# Altium schematic sheet main.SchDoc
size A4; SheetNumber: 1; SheetTotal: 5
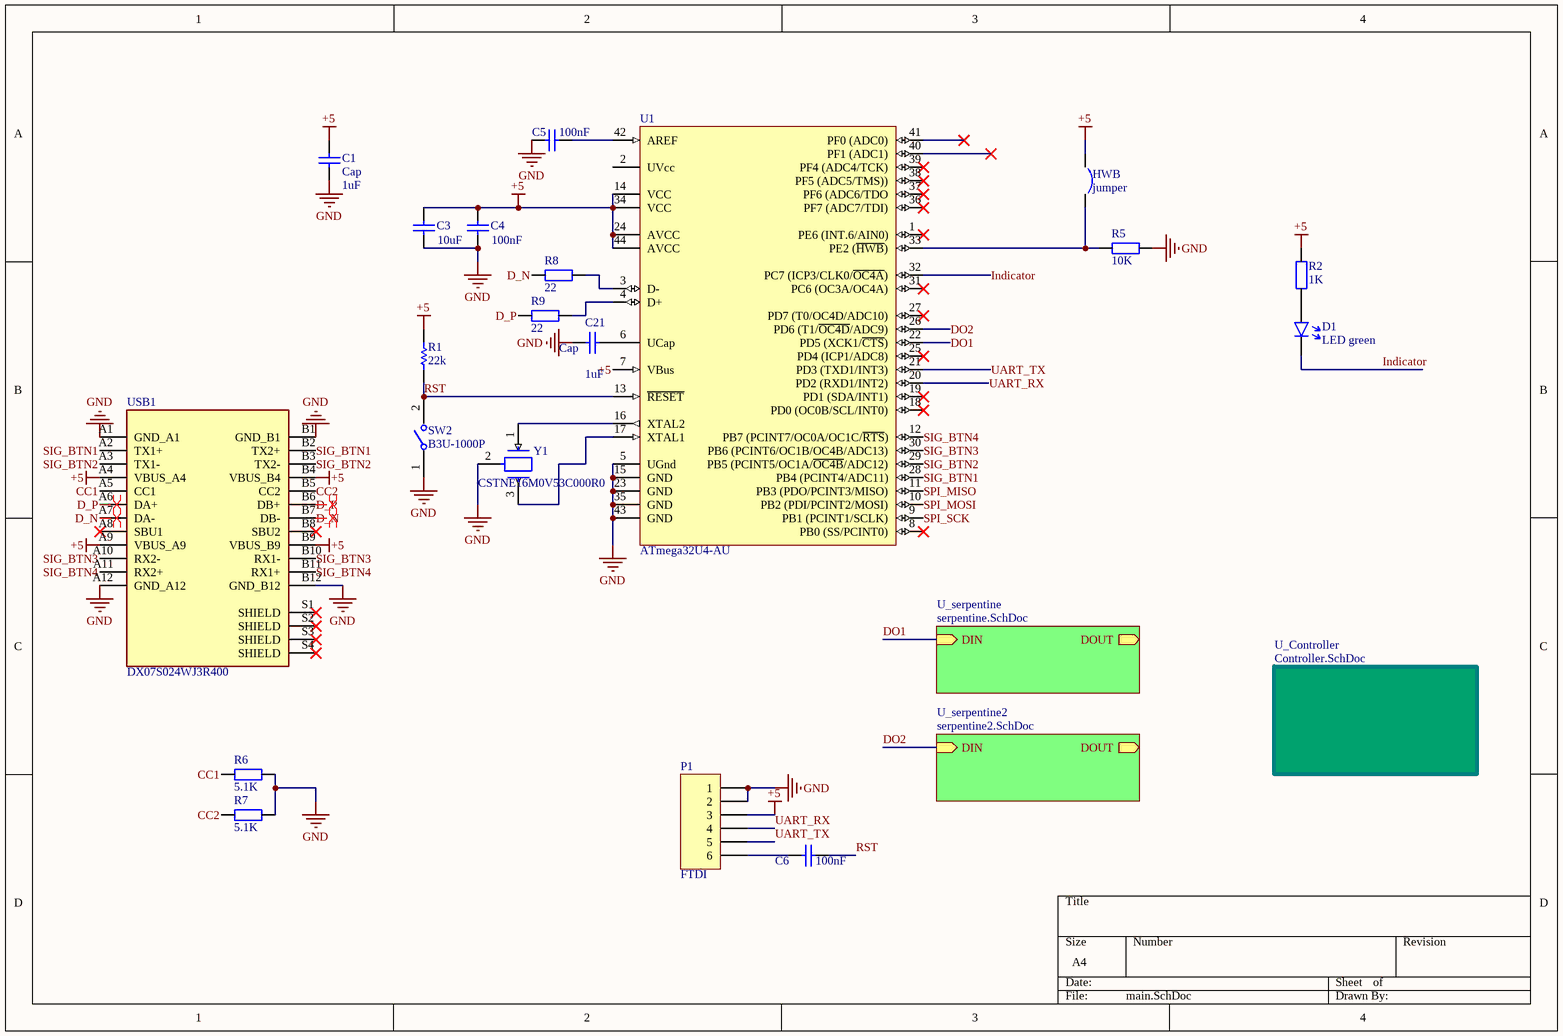
[diagram p0: main.SchDoc]

## Parts
C1  Cap  value 1uF  [6-0805_M]
C3  value 10uF  [6-0805_N]  (hidden comment: Cap)
C4  value 100nF  [6-0805_N]  (hidden comment: Cap)
C5  value 100nF  [6-0805_N]  (hidden comment: Cap)
C6  value 100nF  [6-0805_N]  (hidden comment: Cap)
C21  Cap  value 1uF  [6-0805_N]
D1  LED green  [LED0805]
HWB  jumper  [smd jumper]
P1  FTDI  [HDR1X6H]
R1  22k  [6-0805_N]
R2  1K  [RES0805]
R5  10K  [RES0805]
R6  5.1K  [RES0805]
R7  5.1K  [RES0805]
R8  22  [RES0805]
R9  22  [RES0805]
SW2  B3U-1000P  [FP-B3U-1000P-MFG]
U1  ATmega32U4-AU  [44ML_M]
USB1  DX07S024WJ3R400  [JAE_DX07S024WJ3R400]
Y1  CSTNE16M0V53C000R0  [FP-CSTNE16M0V53C000R0-MFG]

## Sub-sheets
U_Controller = Controller.SchDoc: no entries
U_serpentine = serpentine.SchDoc: DIN (in), DOUT (out)
U_serpentine2 = serpentine2.SchDoc: DIN (in), DOUT (out)

## Nets
+5: C1.1 C3.1 C4.1 HWB.1 P1.3 R1.2 R2.1 U1.7(VBus) U1.14(VCC) U1.24(AVCC) U1.34(VCC) U1.44(AVCC) USB1.A4(VBUS_A4) USB1.A9(VBUS_A9) USB1.B4(VBUS_B4) USB1.B9(VBUS_B9)
GND: C1.2 C3.2 C4.2 C5.2 C21.2 P1.1 P1.2 R5.2 R6.2 R7.2 SW2.1 U1.5(UGnd) U1.15(GND) U1.23(GND) U1.35(GND) U1.43(GND) USB1.A1(GND_A1) USB1.A12(GND_A12) USB1.B1(GND_B1) USB1.B12(GND_B12) Y1.2(GND)
CC1: R6.1 USB1.A5(CC1)
CC2: R7.1 USB1.B5(CC2)
D_N: R8.1 USB1.A7(DA-) USB1.B7(DB-)
D_P: R9.1 USB1.A6(DA+) USB1.B6(DB+)
DO1: U1.22(PD5_(XCK1/~{CTS})) ; sheet U_serpentine/DIN
DO2: U1.26(PD6_(T1/~{OC4D}/ADC9)) ; sheet U_serpentine2/DIN
Indicator: D1.2 U1.32(PC7_(ICP3/CLK0/~{OC4A}))
RST: C6.1 R1.1 SW2.2 U1.13(~{RESET})
SIG_BTN1: U1.28(PB4_(PCINT4/ADC11)) USB1.A2(TX1+) USB1.B2(TX2+)
SIG_BTN2: U1.29(PB5_(PCINT5/OC1A/~{OC4B}/ADC12)) USB1.A3(TX1-) USB1.B3(TX2-)
SIG_BTN3: U1.30(PB6_(PCINT6/OC1B/OC4B/ADC13)) USB1.A10(RX2-) USB1.B10(RX1-)
SIG_BTN4: U1.12(PB7_(PCINT7/OC0A/OC1C/~{RTS})) USB1.A11(RX2+) USB1.B11(RX1+)
SPI_MISO: U1.11(PB3_(PDO/PCINT3/MISO))
SPI_MOSI: U1.10(PB2_(PDI/PCINT2/MOSI))
SPI_SCK: U1.9(PB1_(PCINT1/SCLK))
UART_RX: P1.4 U1.20(PD2_(RXD1/INT2))
UART_TX: P1.5 U1.21(PD3_(TXD1/INT3))
NetC5_1: C5.1 U1.42(AREF)
NetC6_2: C6.2 P1.6
NetC21_1: C21.1 U1.6(UCap)
NetD1_1: D1.1(A) R2.2
NetHWB_2: HWB.2 R5.1 U1.33(PE2_(~{HWB}))
NetR8_2: R8.2 U1.3(D-)
NetR9_2: R9.2 U1.4(D+)
NetU1_16: U1.16(XTAL2) Y1.1(Input)
NetU1_17: U1.17(XTAL1) Y1.3(Output)

Not connected (* = marked no-connect by the designer): U1 1(PE6_(INT.6/AIN0))* 2(UVcc) 8(PB0_(SS/PCINT0))* 18(PD0_(OC0B/SCL/INT0))* 19(PD1_(SDA/INT1))* 25(PD4_(ICP1/ADC8))* 27(PD7_(T0/OC4D/ADC10))* 31(PC6_(OC3A/OC4A))* 36(PF7_(ADC7/TDI))* 37(PF6_(ADC6/TDO)* 38(PF5_(ADC5/TMS)))* 39(PF4_(ADC4/TCK))* 40(PF1_(ADC1))* 41(PF0_(ADC0))*; USB1 A8(SBU1)* B8(SBU2)* S1(SHIELD)* S2(SHIELD)* S3(SHIELD)* S4(SHIELD)*

## Layout directives
differential pair: D_N, D_P

## Library data of the parts
C1 = Cap: C107456; Published: 8-Jun-2000; LatestRevisionDate: 17-Jul-2002; LatestRevisionNote: Re-released for DXP Platform.; PackageReference: RAD-0.3; Publisher: Altium Limited; PackageDescription: Radial Cap, Thru-Hole; 2 Leads; 0.3 in Pin Spacing
C3 = Cap: C40894; Published: 8-Jun-2000; LatestRevisionDate: 17-Jul-2002; LatestRevisionNote: Re-released for DXP Platform.; PackageReference: RAD-0.3; Publisher: Altium Limited; PackageDescription: Radial Cap, Thru-Hole; 2 Leads; 0.3 in Pin Spacing
C4-C6 = Cap: C282730; Published: 8-Jun-2000; LatestRevisionDate: 17-Jul-2002; LatestRevisionNote: Re-released for DXP Platform.; PackageReference: RAD-0.3; Publisher: Altium Limited; PackageDescription: Radial Cap, Thru-Hole; 2 Leads; 0.3 in Pin Spacing
C21 = Cap: C393688; Published: 8-Jun-2000; LatestRevisionDate: 17-Jul-2002; LatestRevisionNote: Re-released for DXP Platform.; PackageReference: RAD-0.3; Publisher: Altium Limited; PackageDescription: Radial Cap, Thru-Hole; 2 Leads; 0.3 in Pin Spacing
D1 = LED single: C84260
P1 = Header 6H: Header, 6-Pin, Right Angle; LatestRevisionDate: 17-Jul-2002; LatestRevisionNote: Re-released for DXP Platform.; Publisher: Altium Limited
R1 = Res1: C269535; Published: 8-Jun-2000; LatestRevisionDate: 17-Jul-2002; LatestRevisionNote: Re-released for DXP Platform.; PackageReference: AXIAL-0.3; Publisher: Altium Limited; PackageDescription: Axial Device, Thru-Hole; 2 Leads; 0.3 in Pin Spacing; Value: 22k
R2 R5-R9 = Resistor: C269744
SW2 = CMP-2100-03586-2: SWITCH TACTILE SPST-NO 0.05A 12V; Contact Resistance: 100mR; Operating Force: 1.5N; Max Current Rating: 50mA; Switch Travel: 0.15mm; Actuator Type: Standard; Mechanical Life: 200000Cycles; Ratings: Dust Proof; Illumination Type: Non-Illuminated; Throw Configuration: SPST; Actuator Length: 0.4mm; Switch Function: Off-Mom; Height: 1.2mm; Width: 3mm; Weight: 0.000776oz; Contact Material: Silver; Max Voltage Rating (DC): 12V; Insulation Resistance: 100MR; Lead Free: Lead Free; Current Rating: 50mA; Termination: SMD/SMT; Length: 4mm; Voltage Rating (DC): 12V; Contact Current Rating: 50mA; Orientation: Straight; Depth: 2.5mm; Max Operating Temperature: 70°C; Packaging: Tape and Reel; Min Operating Temperature: -25°C; Package Quantity: 1; Mount: Surface Mount; Electrical Life: 200000Cycles
U1 = CMP-0095-00285-2: 8-bit AVR Microcontroller, 2.7-5.5V, 16MHz, 32KB Flash, 1KB EEPROM, 2.5KB SRAM, USB Controller, 44-pin TQFP, Industrial Grade (-40°C to 85°C), Ext Osc; RevisionNote: DatasheetVersion updated. URLs added.; ComponentLink1Description: Manufacturer URL; PackageDescription: 44-Pin Plastic Thin Quad Flat Pack, 10 x 10 x 1.0 mm Body, 0.8 mm Pitch (TQFP); DatasheetVersion: revF, Nov-2010; ComponentLink2URL: http://www.atmel.com/dyn/resources/prod_documents/doc7766.pdf; ComponentLink1URL: http://www.atmel.com/; PackageReference: 44ML; ComponentLink2Description: ATmega16U4/32U4 Datasheet; PackageVersion: rev.G, Jul-2007; ComponentLink3URL: http://www.atmel.com/dyn/resources/prod_documents/7766S.pdf; ComponentLink3Description: ATmega16U4 ATmega32U4 Summary
USB1 = DX07S024WJ3R400: Conn Rcpt Usb3.1 Typec Smd Vert; MF: {'manufacturer': u'JAE Electronics'}; Price: None; MP: DX07S024WJ3R400; Package: None; Value: *; Availability: Unavailable
Y1 = CMP-06057-000009-1: CERAMIC RES 16.0000MHZ 15PF SMD; Impedance: 40R; Frequency Stability: 0.15%; Frequency: 16MHz; Frequency Tolerance: 0.5%; Capacitance: 15pF; Resistor Type: Ceramic; Min Operating Temperature: -40°C; Case/Package: SMD/SMT; Packaging: Tape and Reel; Max Operating Temperature: 125°C; Mount: Surface Mount